# Altium schematic sheet Humidity.SchDoc
size A; SheetNumber: 16; SheetTotal: 30
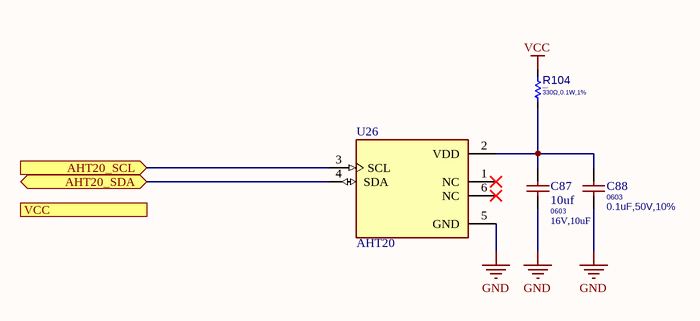
[diagram p0: Humidity.SchDoc]

## Parts
C87  10uf  value 16V,10uF  Package: 0603  [CAPC1608X90N]
C88  Package: 0603  [C0603]  (hidden comment: 0.1uF,50V,10%)
R104  value 330Ω,0.1W,1%  Package: 0603  [R0603]  (hidden comment: 330Ω)
U26  AHT20  [PSON100P300X300X110-6N]

## Ports
AHT20_SCL (in), AHT20_SDA (bidir), VCC (in)

## Nets
GND: C87.1 C88.1 U26.5(GND)
VCC: R104.2
AHT20_SCL: U26.3(SCL) ; port AHT20_SCL
AHT20_SDA: U26.4(SDA) ; port AHT20_SDA
NetC87_2: C87.2 C88.2 R104.1 U26.2(VDD)

Not connected (* = marked no-connect by the designer): U26 1(NC)* 6(NC)*

## Library data of the parts
C87 = 0603F106M160NT: 16V 10uF Y5V ±20% 0603 Multilayer Ceramic Capacitors MLCC - SMD/SMT ROHS; Manufacturer: KEMET; MPN: CC0603KRX7R9BB104; Datasheet: http://componentsearchengine.com/Datasheets/3/CC0603KRX7R9BB104.pdf; LCSC: C48906
C88 = GCM188R71H104KA57J: CAP CER 0.1UF 50V X7R 0603; Manufacturer: Murata Electronics; Type: SM; Min Operating Temp: -55°C; Max Operating Temp: 125°C; MPN: GCM188R71H104KA57J; Datasheet: https://datasheet.lcsc.com/lcsc/2404081050_Murata-Electronics-GCM188R71H104KA57J_C3011652.pdf; LCSC: C3011652; Value: 0.1uF,50V,10%
R104 = RC0603FR-07330RL: 330 Ohms ±1% 0.1W, 1/10W Chip Resistor 0603 (1608 Metric) Moisture Resistant Thick Film; Manufacturer: YAGEO; MPN: RC0603FR-07330RL; Max Operating Temp: +155; Min Operating Temp: -55; Datasheet: https://datasheet.lcsc.com/lcsc/2304140030_YAGEO-RC0603FR-07330RL_C105881.pdf; LCSC: C105881
U26 = AHT20: Temperature and Humidity sensor; MF: Asair; SnapEDA_Link: https://www.snapeda.com/parts/AHT20/Asair/view-part/?ref=snap; MP: AHT20; Check_prices: https://www.snapeda.com/parts/AHT20/Asair/view-part/?ref=eda; Price: None; Value: *; Availability: Not in stock; Package: Package